# Altium schematic sheet Controller.SchDoc
size A4; SheetNumber: 1; SheetTotal: 2
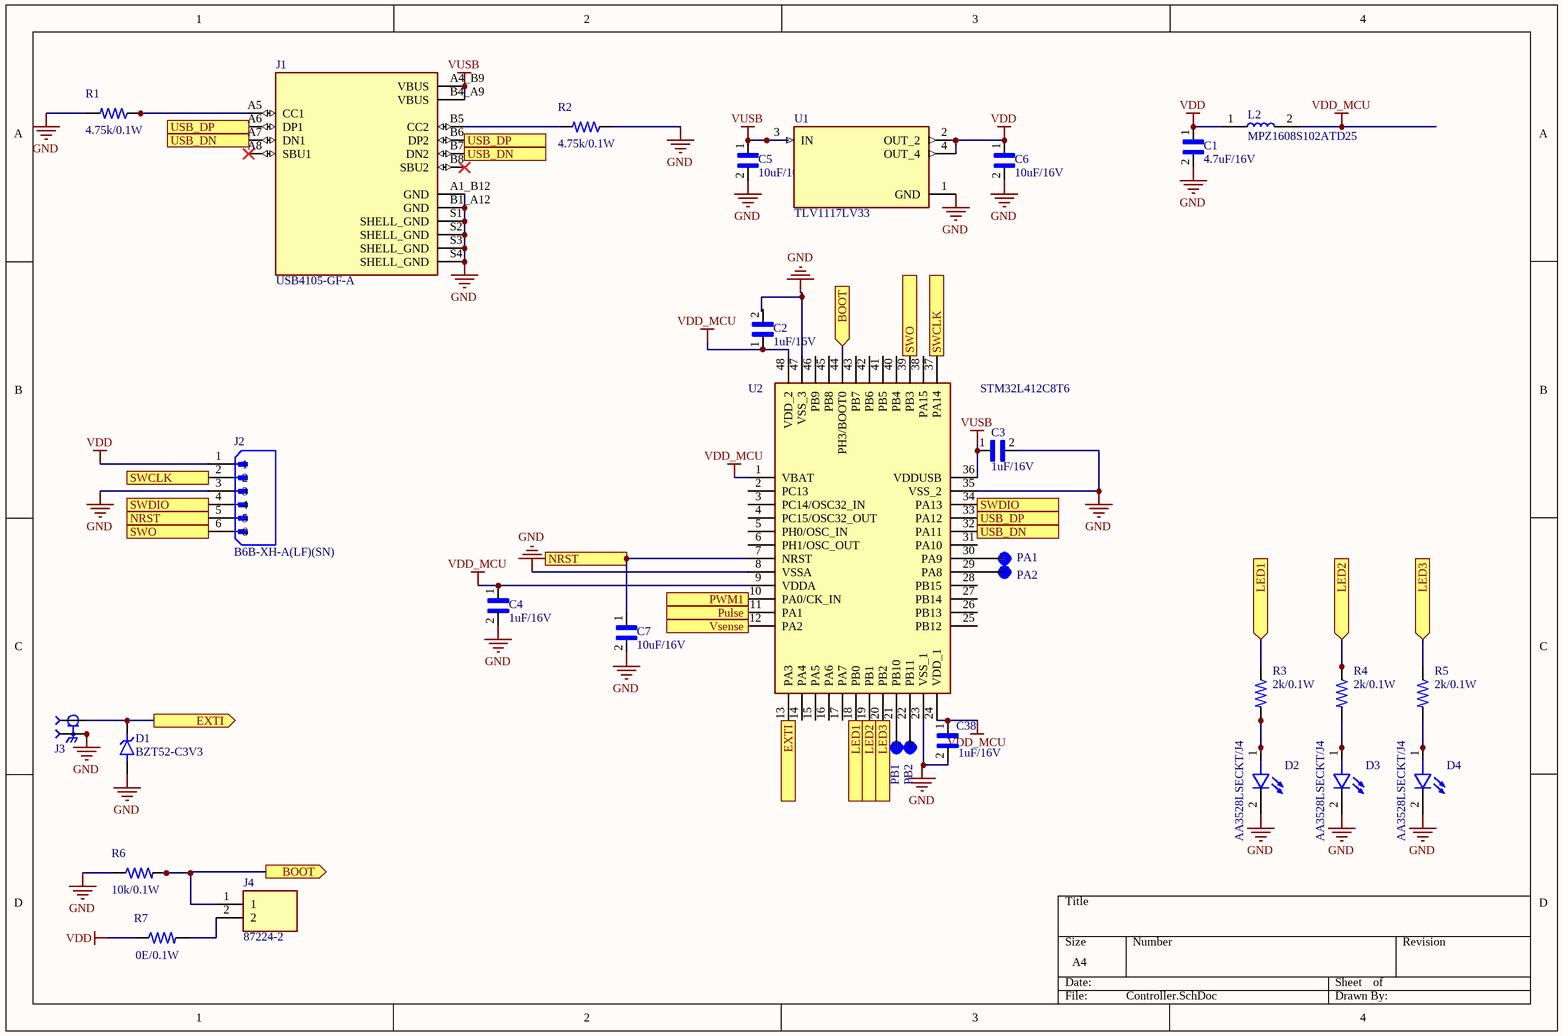
[diagram p0: Controller.SchDoc]

## Parts
C1  4.7uF/16V  [CAPC1608X90]
C2  1uF/16V  [CAPC1608X90]
C3  1uF/16V  [CAPC1608X90]
C4  1uF/16V  [CAPC1608X90]
C5  10uF/16V  [CAPC1608X90]
C6  10uF/16V  [CAPC1608X90]
C7  10uF/16V  [CAPC1608X90]
C38  1uF/16V  [CAPC1608X90]
D1  BZT52-C3V3  [SOD3715X145N]
D2  AA3528LSECKT/J4  [LED_OF-SMD3528WC]
D3  AA3528LSECKT/J4  [LED_OF-SMD3528WC]
D4  AA3528LSECKT/J4  [LED_OF-SMD3528WC]
J1  USB4105-GF-A  [GCT_USB4105-GF-A]
J2  B6B-XH-A(LF)(SN)  [JST_B6B-XH-A(LF)(SN)]
J3  SMA-J-P-X-ST-EM3  [SAMTEC_SMA-J-P-X-ST-EM3]  (value not drawn)
J4  87224-2  [TE_87224-2]
L2  MPZ1608S102ATD25  [INDC1608X95N]
PA1  5019  [KEYSTONE_5019]  (value not drawn)
PA2  5019  [KEYSTONE_5019]  (value not drawn)
PB1  5019  [KEYSTONE_5019]  (value not drawn)
PB2  5019  [KEYSTONE_5019]  (value not drawn)
R1  4.75k/0.1W  [RESC1608X50N]
R2  4.75k/0.1W  [RESC1608X50N]
R3  2k/0.1W  [RESC1608X50N]
R4  2k/0.1W  [RESC1608X50N]
R5  2k/0.1W  [RESC1608X50N]
R6  10k/0.1W  [RESC1608X50N]
R7  0E/0.1W  [RESC1608X50N]
U1  TLV1117LV33  [VREG_TLV1117LV33DCYR]
U2  STM32L412C8T6  [QFP50P900X900X160-48N]

## Ports
BOOT (in, see Controller[1D]), BOOT (out, see Controller[3B]), EXTI (in, see Controller[1C], Power[1D]), EXTI (out, see Controller[3D], Power[1D]), LED1 (in, see Controller[3D]), LED1 (out, see Controller[4C]), LED2 (in, see Controller[3D]), LED2 (out, see Controller[4C]), LED3 (in, see Controller[3D]), LED3 (out, see Controller[4C]), NRST (see Controller[1C]), NRST (see Controller[2C]), Pulse (out, see Power[1D]), PWM1 (out, see Power[1B]), SWCLK (see Controller[1B]), SWCLK (see Controller[3B]), SWDIO (see Controller[1B]), SWDIO (see Controller[3B]), SWO (see Controller[1C]), SWO (see Controller[3B]), USB_DN (see Controller[1A], Controller[2A]), USB_DN (see Controller[1A], Controller[3C]), USB_DN (see Controller[2A], Controller[3C]), USB_DP (see Controller[1A], Controller[2A]), USB_DP (see Controller[1A], Controller[3C]), USB_DP (see Controller[2A], Controller[3C]), Vsense (in, see Power[3C])

## Nets
GND: C1.2 C3.2 C4.2 C5.2 C6.2 C7.2 C38.2 D1.A D2.2(C) D3.2(C) D4.2(C) J1.A1_B12(GND) J1.B1_A12(GND) J1.S1(SHELL_GND) J1.S2(SHELL_GND) J1.S3(SHELL_GND) J1.S4(SHELL_GND) J2.3 J3.2 J3.3 R1.2 R2.1 R6.1 U1.1(GND) U2.8(VSSA) U2.23(VSS_1) U2.35(VSS_2) U2.47(VSS_3)
VDD: C1.1 C6.1 J2.1 L2.1 R7.1 U1.2(OUT_2) U1.4(OUT_4)
VDD_MCU: C2.1 C4.1 C38.1 L2.2 U2.1(VBAT) U2.9(VDDA) U2.24(VDD_1) U2.48(VDD_2)
VUSB: C3.1 C5.1 J1.A4_B9(VBUS) J1.B4_A9(VBUS) U1.3(IN) U2.36(VDDUSB)
BOOT: J4.1 R6.2 U2.44(PH3/BOOT0) ; port BOOT
EXTI: D1.C J3.1 U2.13(PA3) ; port EXTI
LED1: R3.1 U2.18(PB0) ; port LED1
LED2: R4.1 U2.19(PB1) ; port LED2
LED3: R5.1 U2.20(PB2) ; port LED3
NRST: C7.1 J2.5 U2.7(NRST) ; port NRST
Pulse: U2.11(PA1) ; port Pulse
PWM1: U2.10(PA0/CK_IN) ; port PWM1
SWCLK: J2.2 U2.37(PA14) ; port SWCLK
SWDIO: J2.4 U2.34(PA13) ; port SWDIO
SWO: J2.6 U2.39(PB3) ; port SWO
USB_DN: J1.A7(DN1) J1.B7(DN2) U2.32(PA11) ; port USB_DN
USB_DP: J1.A6(DP1) J1.B6(DP2) U2.33(PA12) ; port USB_DP
Vsense: U2.12(PA2) ; port Vsense
NetD2_1: D2.1(A) R3.2
NetD3_1: D3.1(A) R4.2
NetD4_1: D4.1(A) R5.2
NetJ1_A5: J1.A5(CC1) R1.1
NetJ1_B5: J1.B5(CC2) R2.2
NetJ4_2: J4.2 R7.2
NetPA1_TP?: PA1.TP?(TP) U2.30(PA9)
NetPA2_TP?: PA2.TP?(TP) U2.29(PA8)
NetPB1_TP?: PB1.TP?(TP) U2.21(PB10)
NetPB2_TP?: PB2.TP?(TP) U2.22(PB11)

Not connected (* = marked no-connect by the designer): C2 2; J1 A8(SBU1)* B8(SBU2)*; U2 2(PC13) 3(PC14/OSC32_IN) 4(PC15/OSC32_OUT) 5(PH0/OSC_IN) 6(PH1/OSC_OUT) 14(PA4) 15(PA5) 16(PA6) 17(PA7) 25(PB12) 26(PB13) 27(PB14) 28(PB15) 31(PA10) 38(PA15) 40(PB4) 41(PB5) 42(PB6) 43(PB7) 45(PB8) 46(PB9)

## Library data of the parts
C1-C7 C38 = CC0603MRX5R7BB106: 0603; Package: None; Price: None; Value: *; MP: CC0603MRX5R7BB106; Availability: Unavailable
D1 = BZT52C3V9-7-F: SOD-123; MF: Diodes Inc.; Package: SOD-123 Diodes Inc.; MP: BZT52C3V9-7-F; Value: *; Availability: Unavailable; SnapEDA_Link: https://www.snapeda.com/parts/BZT52C3V9-7-F/Diodes%20Inc./view-part/270582/?ref=snap; Price: None
D2-D4 = OF-SMD3528WC: PLCC2; MF: Optoflash; Availability: Not in stock; SnapEDA_Link: https://www.snapeda.com/parts/OF-SMD3528WC/Optoflash/view-part/?ref=snap; MP: OF-SMD3528WC; Value: *; Price: None; Package: PLCC-2 Optoflash; Check_prices: https://www.snapeda.com/parts/OF-SMD3528WC/Optoflash/view-part/?ref=eda
J1 = USB4105-GF-A: USB-C (USB TYPE-C) USB 2.0 Receptacle Connector 24 (16+8 Dummy) Position Surface Mount, Right Angle; Through Hole; MF: GCT; Price: None; Availability: In Stock; MP: USB4105-GF-A; Package: None; SnapEDA_Link: https://www.snapeda.com/parts/USB4105-GF-A/Global+Connector+Technology/view-part/?ref=snap; Check_prices: https://www.snapeda.com/parts/USB4105-GF-A/Global+Connector+Technology/view-part/?ref=eda; Value: *; Purchase-URL: https://pricing.snapeda.com/search/part/USB4105-GF-A/?ref=eda
J2 = B6B-XH-A(LF)(SN): Connector Header Through Hole 6 position 0.098 (2.50mm); MF: JST Sales; MP: B6B-XH-A(LF)(SN); SnapEDA_Link: https://www.snapeda.com/parts/B6B-XH-A(LF)(SN)/JST+Sales+America+Inc./view-part/?ref=snap; Price: None; Check_prices: https://www.snapeda.com/parts/B6B-XH-A(LF)(SN)/JST+Sales+America+Inc./view-part/?ref=eda; Availability: In Stock; Package: None; Purchase-URL: https://pricing.snapeda.com/search/part/B6B-XH-A(LF)(SN)/?ref=eda; Value: *
J3 = SMA-J-P-X-ST-EM3: RF Connectors / Coaxial Connectors; MF: Samtec; Price: None; Package: None; Availability: Unavailable; Value: *; MP: SMA-J-P-X-ST-EM3
J4 = 87224-2: Connector Unshrouded Header HDR 2 Position 2.54mm Solder Straight Thru-Hole; MF: TE Connectivity; Number_of_Positions: 2; Centerline_Pitch: 2.54 mm[.1 in]; Value: *; EU_RoHS_Compliance: Compliant; SnapEDA_Link: https://www.snapeda.com/parts/87224-2/TE%20Connectivity%20AMP%20Connectors/view-part/494877/?ref=snap; Price: None; Availability: Unavailable; TE_purchase_URL: https://www.te.com/usa-en/product-87224-2.html?te_bu=Cor&te_type=disp&te_campaign=seda_glo_cor-seda-global-disp-prtnr-fy19-seda-model-bom-cta_sma-317_1&elqCampaignId=32493; Package: None; Product_Type: Connector; MP: 87224-2
L2 = MMZ1608Y150B: 0603; Package: None; Price: None; Value: *; MP: MMZ1608Y150B; Availability: Unavailable
PA1 PA2 PB1 PB2 = 5019: SMT Test Point- Mininature-1000 pc Reels; MF: Keystone Electronics; Value: *; MP: 5019; Availability: In Stock; Purchase-URL: https://pricing.snapeda.com/search/part/5019/?ref=eda; Package: None; Price: None
R1-R7 = 3-1879460-5: RES 0.27 OHM 1% 1/10W 0603; MF: TE Connectivity; Power_Rating: .1 W; Resistance: 27; Value: *; Check_prices: https://www.snapeda.com/parts/3-1879460-5/TE+Connectivity/view-part/?ref=eda; Availability: In Stock; Package: 0603; Tolerance: 1%; SnapEDA_Link: https://www.snapeda.com/parts/3-1879460-5/TE+Connectivity/view-part/?ref=snap; Price: None; EU_RoHS_Compliance: Compliant with Exemptions; MP: 3-1879460-5
U1 = TLV1117LV33DCYR: 1-A, low-dropout voltage regulator; MF: Texas Instruments; Check_prices: https://www.snapeda.com/parts/TLV1117LV33DCYR/Texas+Instruments/view-part/?ref=eda; Value: *; MP: TLV1117LV33DCYR; Purchase-URL: https://pricing.snapeda.com/search/part/TLV1117LV33DCYR/?ref=eda; SnapEDA_Link: https://www.snapeda.com/parts/TLV1117LV33DCYR/Texas+Instruments/view-part/?ref=snap; Package: SOT-223-4 Texas Instruments; Digi-Key_Part_Number: 296-28778-2-ND
U2 = STM32L412C8T6: STMICROELECTRONICS - STM32L412C8T6 - MCU, 32BIT, 80MHZ; Geometry.Height: 1.6mm; Arrow Part Number: STM32L412C8T6; Arrow Price/Stock: https://www.arrow.com/en/products/stm32l412c8t6/stmicroelectronics?region=nac; Manufacturer_Name: STMicroelectronics; Manufacturer_Part_Number: STM32L412C8T6; Datasheet Link: https://www.arrow.com/en/products/stm32l412c8t6/stmicroelectronics?region=nac